# EAGLE schematic schematic (EAGLE 9.6.2)
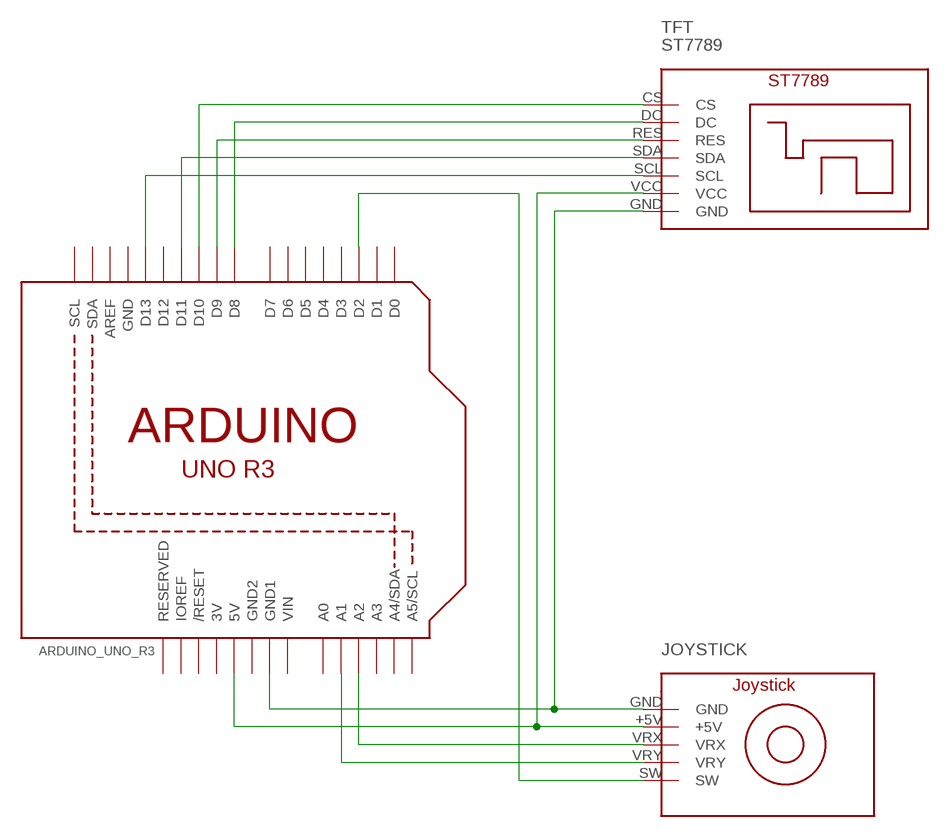
[diagram p0: schematic, sheet 1]

## Parts
ARDUINO_UNO_R3  ARDUINOR3-BPLACE  [ARDUINOR3-BPLACE]
JOYSTICK  JOYSTICK  [FP_JOYSTICK]
U$1  ST7789  [FP_ST7789]

## Nets
N$1: ARDUINO_UNO_R3.5V JOYSTICK.+5V U$1.VCC
N$2: ARDUINO_UNO_R3.GND1 JOYSTICK.GND U$1.GND
N$3: ARDUINO_UNO_R3.A2 JOYSTICK.VRX
N$4: ARDUINO_UNO_R3.A1 JOYSTICK.VRY
N$5: ARDUINO_UNO_R3.D10 U$1.CS
N$6: ARDUINO_UNO_R3.D2 JOYSTICK.SW
N$7: ARDUINO_UNO_R3.D8 U$1.DC
N$8: ARDUINO_UNO_R3.D9 U$1.RES
N$9: ARDUINO_UNO_R3.D11 U$1.SDA
N$10: ARDUINO_UNO_R3.D13 U$1.SCL
Unconnected: ARDUINO_UNO_R3.A0 ARDUINO_UNO_R3.A3 ARDUINO_UNO_R3.A4(A4/SDA) ARDUINO_UNO_R3.A5(A5/SCL) ARDUINO_UNO_R3.AREF ARDUINO_UNO_R3.D0 ARDUINO_UNO_R3.D1 ARDUINO_UNO_R3.D3 ARDUINO_UNO_R3.D4 ARDUINO_UNO_R3.D5 ARDUINO_UNO_R3.D6 ARDUINO_UNO_R3.D7 ARDUINO_UNO_R3.D12 ARDUINO_UNO_R3.IOREF ARDUINO_UNO_R3.RESERVED ARDUINO_UNO_R3.RESET(/RESET) ARDUINO_UNO_R3.SCL ARDUINO_UNO_R3.SDA

## Power pins joined to a net without a drawn wire
3V: ARDUINO_UNO_R3.3V
GND: ARDUINO_UNO_R3.GND
GND2: ARDUINO_UNO_R3.GND2
VIN: ARDUINO_UNO_R3.VIN

## Library data of the parts
ARDUINO_UNO_R3 = adafruit:ARDUINOR3: This is a new object for the new Arduino R3 - with extra pins that you may want to use (such as IOref, and duplicated A4/A5
JOYSTICK = custom:JOYSTICK
U$1 = custom:ST7789